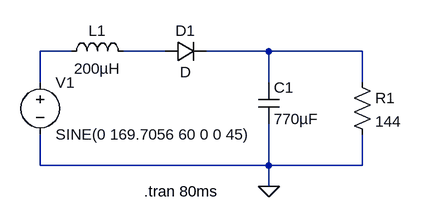
[diagram p0: schematic 1diode-120VAC-60Hz-770uF-144Ohm-Ls200uH.asc]
1diode-120VAC-60Hz-770uF-144Ohm-Ls200uH.asc, the LTspice schematic file:
Version 4
SHEET 1 880 680
WIRE 0 112 -48 112
WIRE 144 112 80 112
WIRE 304 112 208 112
WIRE 448 112 304 112
WIRE -48 160 -48 112
WIRE 304 160 304 112
WIRE 448 160 448 112
WIRE -48 288 -48 240
WIRE 304 288 304 224
WIRE 304 288 -48 288
WIRE 448 288 448 240
WIRE 448 288 304 288
WIRE 304 320 304 288
FLAG 304 320 0
SYMBOL cap 288 160 R0
SYMATTR InstName C1
SYMATTR Value 770µF
SYMBOL res 432 144 R0
SYMATTR InstName R1
SYMATTR Value 144
SYMBOL diode 144 128 R270
WINDOW 0 32 32 VTop 2
WINDOW 3 0 32 VBottom 2
SYMATTR InstName D1
SYMBOL voltage -48 144 R0
WINDOW 123 24 124 Left 2
WINDOW 39 0 0 Left 2
SYMATTR InstName V1
SYMATTR Value SINE(0 169.7056 60 0 0 45)
SYMBOL ind -16 128 R270
WINDOW 0 32 56 VTop 2
WINDOW 3 5 56 VBottom 2
SYMATTR InstName L1
SYMATTR Value 200µH
TEXT 112 328 Left 2 !.tran 80ms

The netlist it stands for:
* 1diode-120VAC-60Hz-770uF-144Ohm-Ls200uH.asc
C1 N003 0 770µF
R1 N003 0 144
D1 N002 N003 D
V1 N001 0 SINE(0 169.7056 60 0 0 45)
L1 N001 N002 200µH
.model D D
.lib standard.dio
.tran 80ms
.backanno
.end